# Altium schematic sheet GENERAL.SchDoc
size A4; SheetNumber: 1; SheetTotal: 12
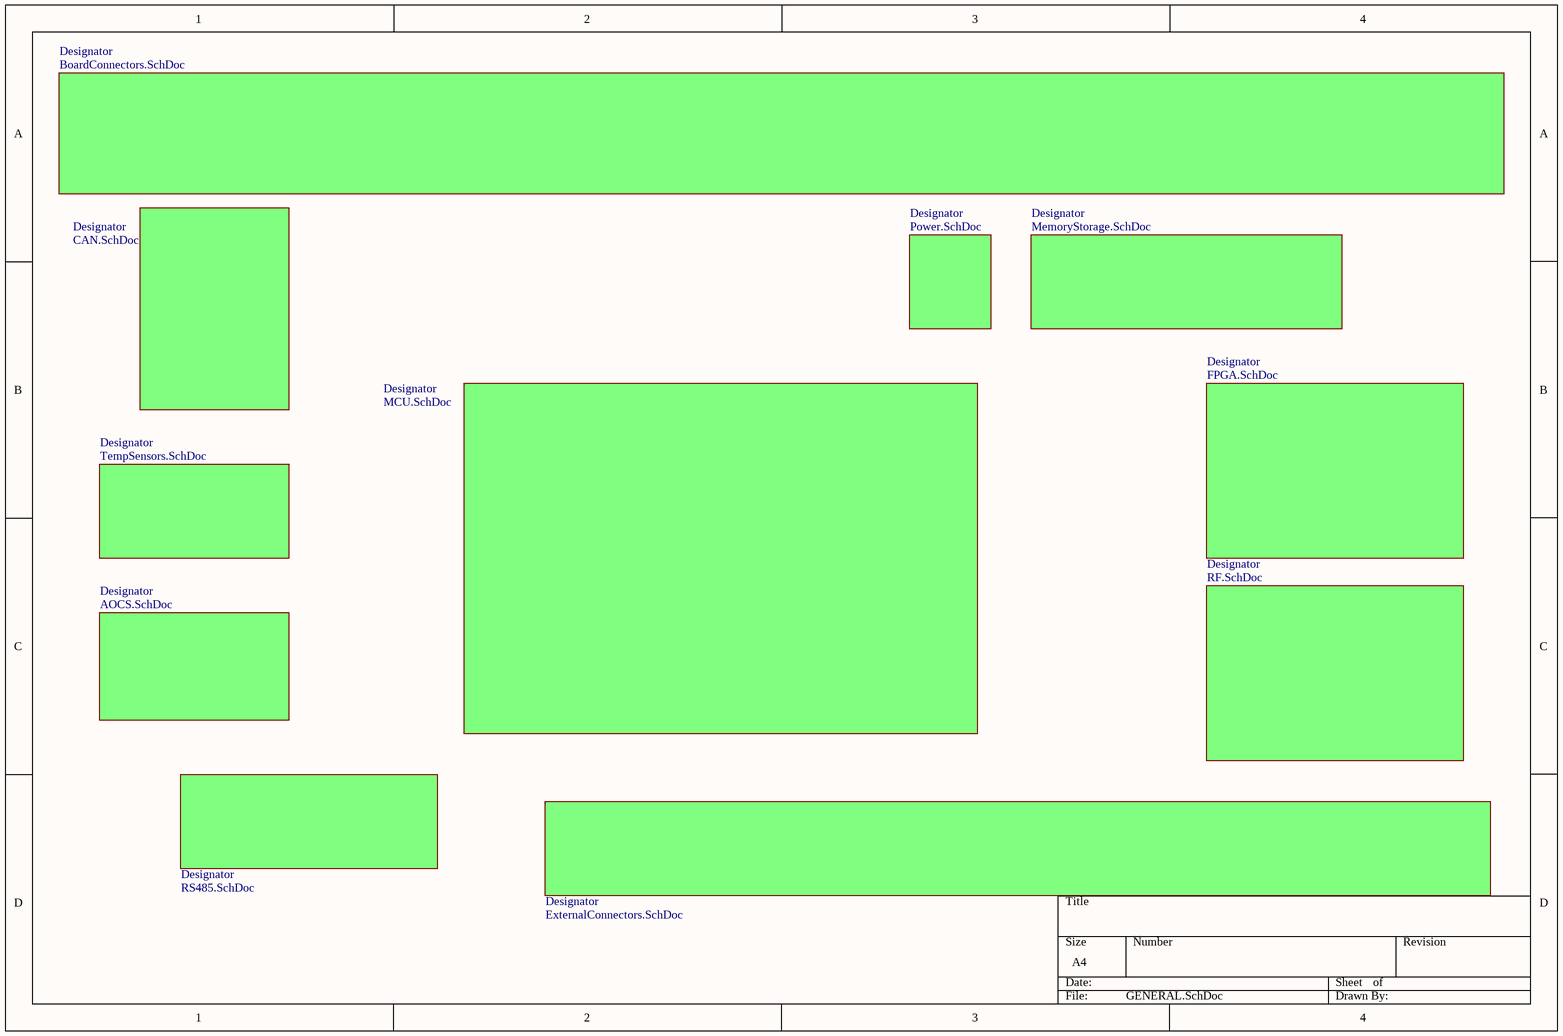
[diagram p0: GENERAL.SchDoc]

## Sub-sheets
Designator = MCU.SchDoc: no entries
Designator = CAN.SchDoc: no entries
Designator = RS485.SchDoc: no entries
Designator = MemoryStorage.SchDoc: no entries
Designator = TempSensors.SchDoc: no entries
Designator = ExternalConnectors.SchDoc: no entries
Designator = BoardConnectors.SchDoc: no entries
Designator = FPGA.SchDoc: no entries
Designator = RF.SchDoc: no entries
Designator = Power.SchDoc: no entries
Designator = AOCS.SchDoc: no entries